# Altium project Flyback.PrjPcb (part 3 of 3)
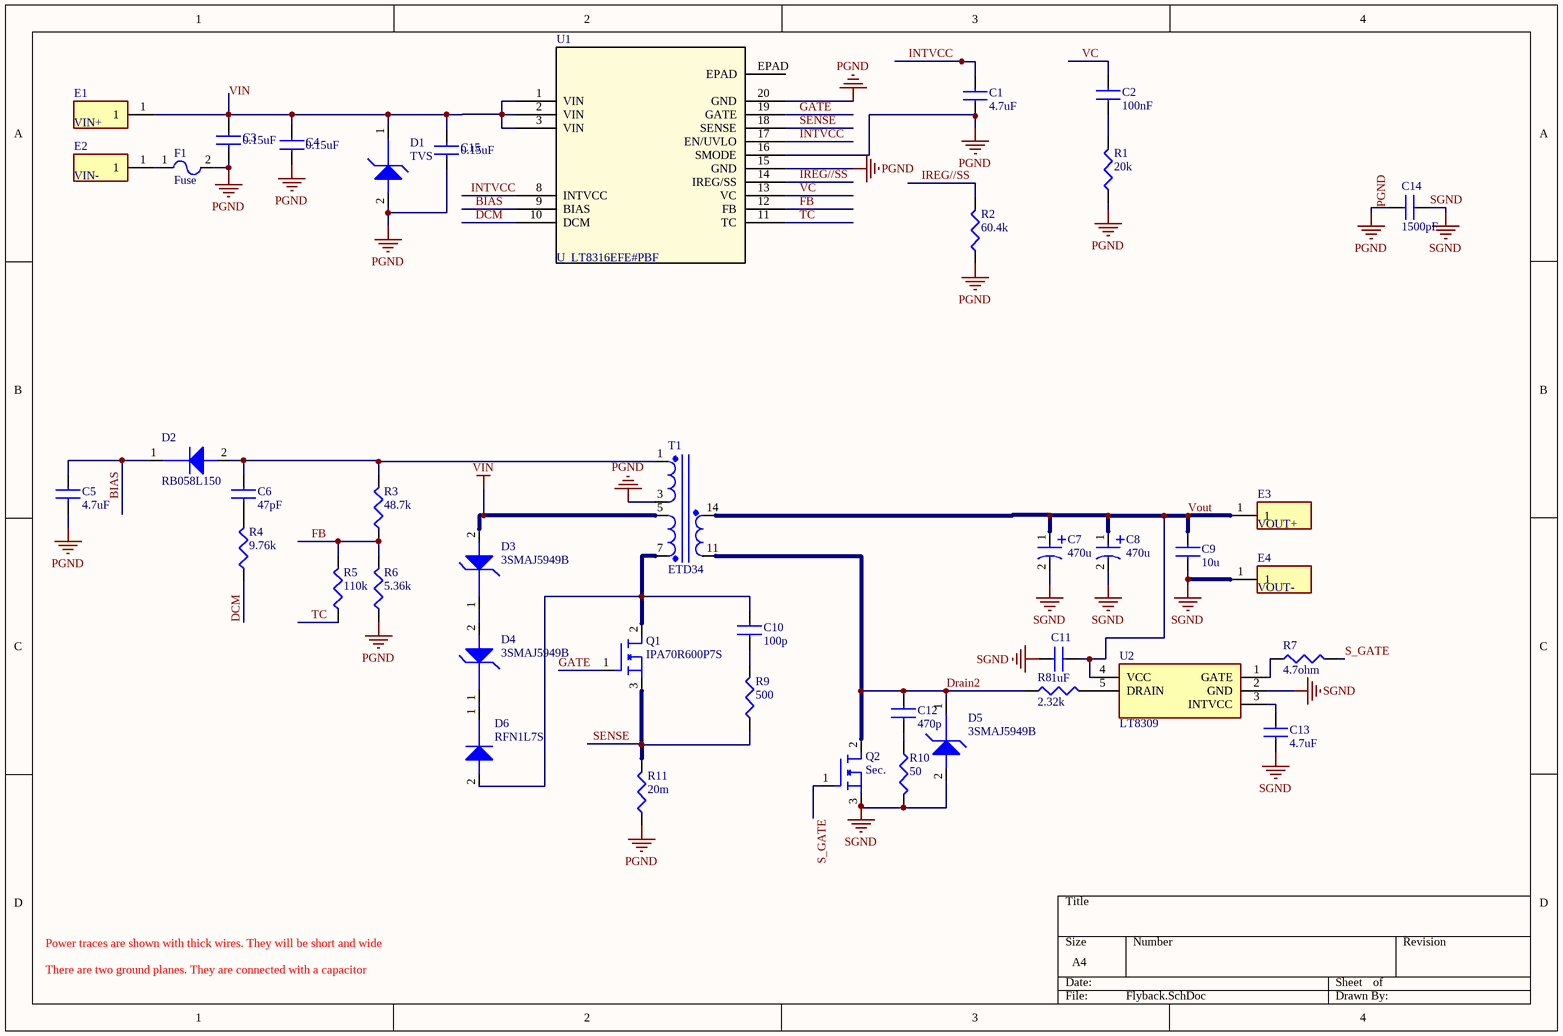
[diagram p2: Flyback.SchDoc]

## Sheet Flyback.SchDoc (continued)

### Library data of the parts (continued)
R9 = R_Snubber_Pri: Res Thick Film 2512 499 Ohm 1% 2W ±100ppm/°C Molded SMD SMD Paper T/R / CRM2512-FX-4990ELF; Manufacturer: Bourns; Resistance: 499R; Supplier 1: Digi-Key; Supplier Part Number 1: 118-CRM2512-FX-4990ELFCT-ND; Manufacturer Part Number: CRM2512-FX-4990ELF; RoHS: Yes; Category: Chip SMD Resistors; Stock 1: 10792; Pricing 1: 1=0,63000, 10=0,44800, 100=0,23320, 1000=0,12558 (USD); Case/Package: 2512; Min Operating Temperature: -55°C; Max Operating Temperature: 155°C; Resistor Type: Thick Film; Max Power Dissipation: 2W; Temperature Coefficient: 100ppm/°C; Number of Terminations: 2; Tolerance: 1%; Power Rating: 2W; Package Quantity: 4000; Packaging: Tape and Reel; Length: 0.248inch; Width: 0.122inch; Height: 0.031inch; ComponentLink1URL: https://datasheet.ciiva.com/9119/crm-9119624.pdf?src-supplier=Avnet; ComponentLink1Description: https://datasheet.ciiva.com/9119/crm-9119624.pdf?src-supplier=Avnet; ComponentLink2URL: https://datasheet.ciiva.com/29521/crm-29521785.pdf?src-supplier=Digi-Key; ComponentLink2Description: https://datasheet.ciiva.com/29521/crm-29521785.pdf?src-supplier=Digi-Key; ComponentLink3URL: https://datasheet.ciiva.com/16929/crm-16929438.pdf?src-supplier=Avnet+Europe; ComponentLink3Description: https://datasheet.ciiva.com/16929/crm-16929438.pdf?src-supplier=Avnet+Europe
R10 = R_Snubber_Sec: Vishay CRCW Series Thick Film Power Resistor 0603 Case 49.9 1% 0.25W 100ppm/K / CRCW060349R9FKEAHP; Manufacturer: Vishay Dale; Resistance: 49.9R; Power Rating: 250mW; Voltage Rating: 75V; Temperature Coefficient: 100ppm/°C; Supplier 1: Digi-Key; Supplier Part Number 1: 541-49.9SCT-ND; Manufacturer Part Number: CRCW060349R9FKEAHP; RoHS: Yes; Category: Chip SMD Resistors; Stock 1: 174736; Pricing 1: 1=0,17000, 10=0,14800, 100=0,05790, 1000=0,02422, 2500=0,02220 (USD); Mount: Surface Mount; Case/Package: 0603; Weight: 7.1E-05oz; Case Code (Metric): 1608; Case Code (Imperial): 0603; Contact Plating: Tin; Min Operating Temperature: -55°C; Max Operating Temperature: 155°C; Tolerance: 1%; Packaging: Tape and Reel; Package Quantity: 10; Resistor Type: Thick Film; Number of Terminations: 2; Termination: SMD/SMT; Max Power Dissipation: 250mW; Features: Automotive AEC-Q200; Series: CRCW-HP; Construction: Rectangular; Technology: THICK FILM; Length: 1.6mm; Width: 0.033inch; Height: 0.45mm; Depth: 0.85mm; Radiation Hardening: No; Military Standard: Not; Lead Free: Lead Free; RoHS Compliant: Yes; ComponentLink1URL: https://datasheet.ciiva.com/9003/crcwhpe3-9003461.pdf?src-supplier=Avnet; ComponentLink1Description: https://datasheet.ciiva.com/9003/crcwhpe3-9003461.pdf?src-supplier=Avnet; ComponentLink2URL: https://datasheet.ciiva.com/2578/crcwhpe3-2578506.pdf?src-supplier=Digi-Key; ComponentLink2Description: https://datasheet.ciiva.com/2578/crcwhpe3-2578506.pdf?src-supplier=Digi-Key; ComponentLink3URL: https://datasheet.ciiva.com/2578/crcwhpe3-2578507.pdf?src-supplier=Digi-Key; ComponentLink3Description: https://datasheet.ciiva.com/2578/crcwhpe3-2578507.pdf?src-supplier=Digi-Key; ComponentLink4URL: https://datasheet.ciiva.com/2578/crcwhpe3-2578508.pdf?src-supplier=Digi-Key; ComponentLink4Description: https://datasheet.ciiva.com/2578/crcwhpe3-2578508.pdf?src-supplier=Digi-Key; ComponentLink5URL: https://datasheet.ciiva.com/48525/crcwhpe3-48525900.pdf?src-supplier=Avnet; ComponentLink5Description: https://datasheet.ciiva.com/48525/crcwhpe3-48525900.pdf?src-supplier=Avnet; ComponentLink6URL: https://datasheet.ciiva.com/5547/crcwhpe3-46056-5547183.pdf?src-supplier=Mouser; ComponentLink6Description: https://datasheet.ciiva.com/5547/crcwhpe3-46056-5547183.pdf?src-supplier=Mouser
R11 = R_Sense: TR / Current Sensors, 0805 0.25W, 5% / RL1220T-R020-J; Manufacturer: Susumu; Power Rating: 250mW; Resistance: 20mR; Temperature Coefficient: 350ppm/°C; Voltage Rating (DC): 100V; Supplier 1: Digi-Key; Supplier Part Number 1: RL12T.020JCT-ND; Manufacturer Part Number: RL1220T-R020-J; RoHS: Yes; Category: Resistors; Stock 1: 301682; Pricing 1: 1=0,35000, 10=0,30000, 25=0,21840, 50=0,15840, 100=0,11740, 250=0,09008, 500=0,07098, 1000=0,04914 (USD); Case/Package: 0805; Case Code (Metric): 2012; Case Code (Imperial): 0805; Weight: 0.000194oz; Min Operating Temperature: -55°C; Max Operating Temperature: 125°C; Tolerance: 5%; Package Quantity: 1; Packaging: Tape and Reel; Series: RL; Resistor Type: Thin Film; Number of Terminations: 2; Termination: SMD/SMT; Max Power Dissipation: 250mW; Technology: THIN FILM; Length: 0.079inch; Width: 0.049inch; Height: 0.028inch; Lead Free: Lead Free; RoHS Compliant: Yes; ComponentLink1URL: https://datasheet.ciiva.com/2488/rl-data-sheet-2488002.pdf?src-supplier=Digi-Key; ComponentLink1Description: https://datasheet.ciiva.com/2488/rl-data-sheet-2488002.pdf?src-supplier=Digi-Key; ComponentLink2URL: https://datasheet.ciiva.com/2488/rl-data-sheet-2488003.pdf?src-supplier=Digi-Key; ComponentLink2Description: https://datasheet.ciiva.com/2488/rl-data-sheet-2488003.pdf?src-supplier=Digi-Key; ComponentLink3URL: https://datasheet.ciiva.com/2488/rl-data-sheet-2488004.pdf?src-supplier=Digi-Key; ComponentLink3Description: https://datasheet.ciiva.com/2488/rl-data-sheet-2488004.pdf?src-supplier=Digi-Key; ComponentLink4URL: https://datasheet.ciiva.com/12915/e-15-16-12915302.pdf?src-supplier=Mouser; ComponentLink4Description: https://datasheet.ciiva.com/12915/e-15-16-12915302.pdf?src-supplier=Mouser
T1 = Transformer_CoilFormer: Epcos B66362W1014T001 ETD 34 Coil Former, 14 Pins / B66362W1014T001; Manufacturer: TDK EPCOS; Material: Polyterephthalate; Inside Diameter: 20.9mm; Outside Diameter: 25.4mm; Supplier 1: Digi-Key; Supplier Part Number 1: 495-5465-ND; Manufacturer Part Number: B66362W1014T001; RoHS: Yes; Category: Coil Former; Pricing 1: 1=1,99000, 10=1,71200, 25=1,30080, 50=1,23240, 100=1,09550, 250=1,02704, 500=0,95858, 1000=0,91065 (USD); Number of Pins: 14; Weight: 1.410958oz; Max Operating Temperature: 180°C; Package Quantity: 100; Termination: Pin; Packaging: Bulk; ComponentLink1URL: https://datasheet.ciiva.com/48906/70419804-48906870.pdf?src-supplier=Allied+Electronics; ComponentLink1Description: https://datasheet.ciiva.com/48906/70419804-48906870.pdf?src-supplier=Allied+Electronics
U1 = U_LT8316EFE#PBF: DC/DC Cntrlr Single-OUT 142kHz Automotive 16-Pin TSSOP EP Tube; Manufacturer: Analog Devices / Linear Technology; Supplier 1: Digi-Key; Supplier Part Number 1: LT8316EFE#PBF-ND; Manufacturer Part Number: LT8316EFE#PBF; RoHS: Yes; Pricing 1: 1=5,81000, 10=5,22200, 25=4,93680, 100=4,27870, 250=4,05928, 500=3,64238, 1000=3,10500 (USD)
U2 = U_LT8309ES5#TRMPBF: IC REG FLYBACK ISO ADJ TSOT23-5; Manufacturer: Analog Devices / Linear Technology; Operating Supply Current: 300uA; Min Supply Voltage: 4.5V; Max Supply Voltage: 40V; Supplier 1: Digi-Key; Supplier Part Number 1: LT8309ES5#TRMPBFCT-ND; Manufacturer Part Number: LT8309ES5#TRMPBF; RoHS: Yes; Category: Voltage Regulators - Switching; Pricing 1: 1=4,92000, 10=4,41500, 25=4,17360, 100=3,61720, 250=3,43176 (USD); Mount: Surface Mount; Case/Package: SOT-23-5; Number of Pins: 5; Min Operating Temperature: -40°C; Max Operating Temperature: 125°C; Packaging: Cut Tape; REACH SVHC: No SVHC; ComponentLink1URL: https://datasheet.ciiva.com/29589/44473-29589472.pdf?src-supplier=Digi-Key; ComponentLink1Description: https://datasheet.ciiva.com/29589/44473-29589472.pdf?src-supplier=Digi-Key; ComponentLink2URL: https://datasheet.ciiva.com/29589/44473-29589470.pdf?src-supplier=Digi-Key; ComponentLink2Description: https://datasheet.ciiva.com/29589/44473-29589470.pdf?src-supplier=Digi-Key; ComponentLink3URL: https://datasheet.ciiva.com/29589/44473-29589471.pdf?src-supplier=Digi-Key; ComponentLink3Description: https://datasheet.ciiva.com/29589/44473-29589471.pdf?src-supplier=Digi-Key